# EAGLE design ir_remote_v3 (EAGLE 8.3.1)
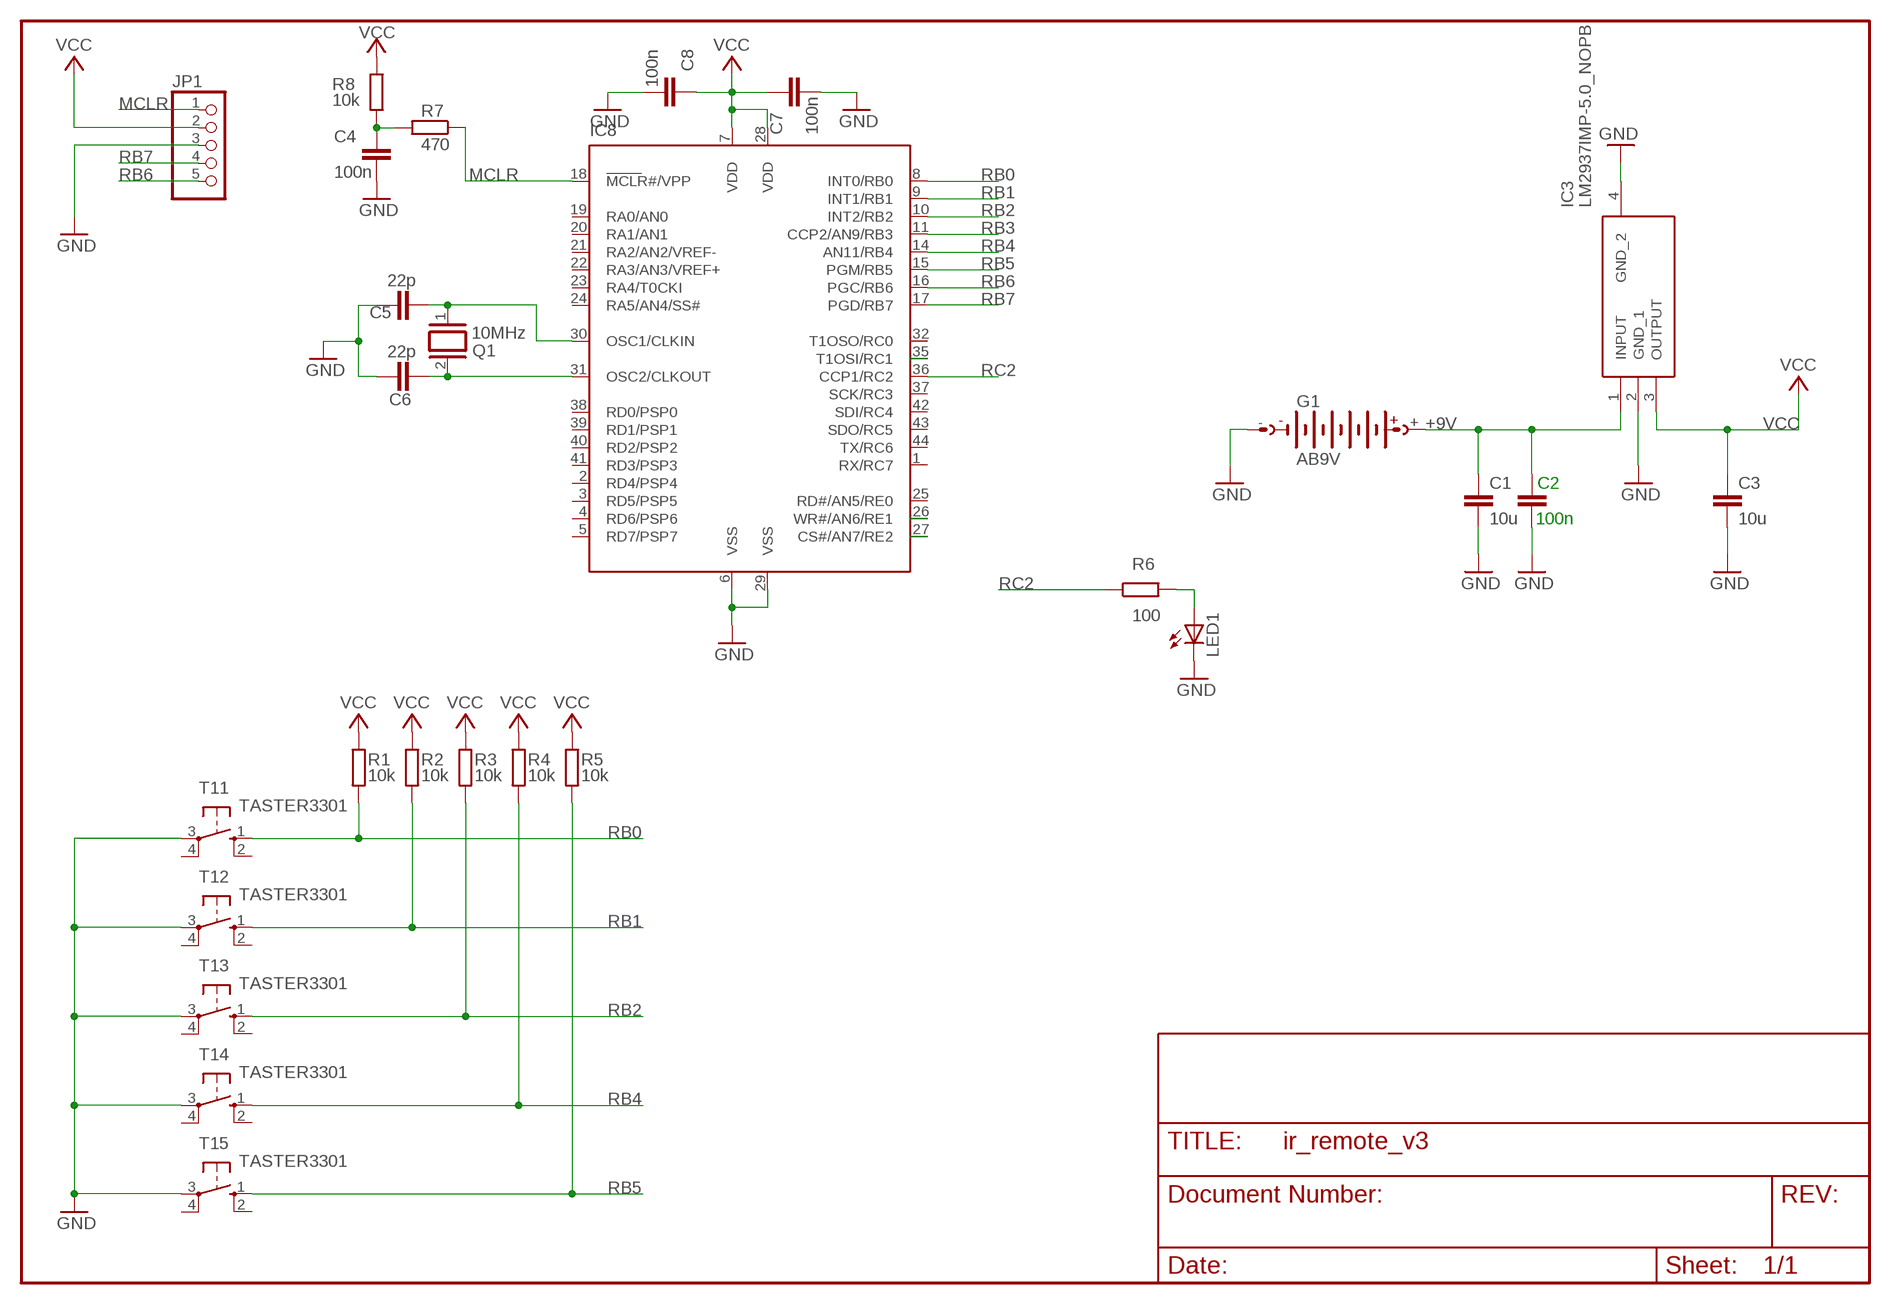
[diagram p0: schematic, sheet 1]

## Parts
C1  10u  C-EUC0805  [C0805]
C2  100n  C-EUC0805  [C0805]
C3  10u  C-EUC0805  [C0805]
C4  100n  C-EUC0805  [C0805]
C5  22p  C-EUC0603_WE  [C0603_WE]
C6  22p  C-EUC0603_WE  [C0603_WE]
C7  100n  C-EUC0805  [C0805]
C8  100n  C-EUC0805  [C0805]
G1  AB9V  [AB9V]
IC3  LM2937IMP-5.0_NOPB  [SOT230P700X180-4N]
IC8  PIC18F4520  [TQFP44]
JP1  PINHD-1X5  [1X05]
LED1  LED5MM  [LED5MM]
Q1  10MHz  XTAL_HC5032  [QUARZ_HC5032/2]
R1  10k  R-EU_M0805  [M0805]
R2  10k  R-EU_M0805  [M0805]
R3  10k  R-EU_M0805  [M0805]
R4  10k  R-EU_M0805  [M0805]
R5  10k  R-EU_M0805  [M0805]
R6  100  R-EU_M0805  [M0805]
R7  470  R-EU_M0805  [M0805]
R8  10k  R-EU_M0805  [M0805]
T11  TASTER3301  [TASTER3301]
T12  TASTER3301  [TASTER3301]
T13  TASTER3301  [TASTER3301]
T14  TASTER3301  [TASTER3301]
T15  TASTER3301  [TASTER3301]

## Nets
+9V: C1.1 C2.1 G1.+ IC3.1(INPUT)
D0_LCD: IC8.27(CS#/AN7/RE2)
D1_LCD: IC8.26(WR#/AN6/RE1)
GND: C1.2 C2.2 C3.2 C4.2 C5.1 C6.1 C7.2 C8.2 G1.- IC3.2(GND_1) IC3.4(GND_2) IC8.6(VSS) IC8.29(VSS) JP1.3 LED1.K(C) T11.3(P) T12.3(P) T13.3(P) T14.3(P) T15.3(P)
MCLR: IC8.18(MCLR#/VPP) JP1.1 R7.1
N$19: LED1.A R6.2
N$24: C4.1 R7.2 R8.2
N$47: C5.2 IC8.30(OSC1/CLKIN) Q1.1
N$48: C6.2 IC8.31(OSC2/CLKOUT) Q1.2
RB0: IC8.8(INT0/RB0) R1.2 T11.1(S)
RB1: IC8.9(INT1/RB1) IC8.35(T1OSI/RC1) R2.2 T12.1(S)
RB2: IC8.10(INT2/RB2) IC8.32(T1OSO/RC0) R3.2 T13.1(S)
RB3: IC8.11(CCP2/AN9/RB3)
RB4: IC8.14(AN11/RB4) R4.2 T14.1(S)
RB5: IC8.15(PGM/RB5) R5.2 T15.1(S)
RB6: IC8.16(PGC/RB6) JP1.5
RB7: IC8.17(PGD/RB7) JP1.4
RC2: IC8.36(CCP1/RC2) R6.1
VCC: C3.1 C7.1 C8.1 IC3.3(OUTPUT) IC8.7(VDD) IC8.28(VDD) JP1.2 R1.1 R2.1 R3.1 R4.1 R5.1 R8.1
Unconnected: IC8.1(RX/RC7) IC8.2(RD4/PSP4) IC8.3(RD5/PSP5) IC8.4(RD6/PSP6) IC8.5(RD7/PSP7) IC8.19(RA0/AN0) IC8.20(RA1/AN1) IC8.21(RA2/AN2/VREF-) IC8.22(RA3/AN3/VREF+) IC8.23(RA4/T0CKI) IC8.24(RA5/AN4/SS#) IC8.25(RD#/AN5/RE0) IC8.37(SCK/RC3) IC8.38(RD0/PSP0) IC8.39(RD1/PSP1) IC8.40(RD2/PSP2) IC8.41(RD3/PSP3) IC8.42(SDI/RC4) IC8.43(SDO/RC5) IC8.44(TX/RC6) T11.2(S1) T11.4(P1) T12.2(S1) T12.4(P1) T13.2(S1) T13.4(P1) T14.2(S1) T14.4(P1) T15.2(S1) T15.4(P1)

## Library data of the parts
C1 C3-C8 = rcl:C-EU: CAPACITOR, European symbol
C2 = rcl_416:C-EU: CAPACITOR, European symbol
G1 = battery:AB9V: 9-V BATTERY CLIP
IC3 = LM2937IMP-5.0_NOPB:LM2937IMP-5.0_NOPB: 500-mA Low Dropout Regulator Source: Datasheet <https://datasheet.datasheetarchive.com/originals/distributors/Datasheets-SFU2/DSASFU100036586.pdf>; DESCRIPTION: 500-mA Low Dropout Regulator; HEIGHT: 1.8mm; MANUFACTURER_NAME: Texas Instruments; MANUFACTURER_PART_NUMBER: LM2937IMP-5.0/NOPB
IC8 = Bernd:PIC18F4520
JP1 = pinhead:PINHD-1X5: PIN HEADER
LED1 = led:LED: LED OSRAM: - CHIPLED LG R971, LG N971, LY N971, LG Q971, LY Q971, LO R971, LY R971 LH N974, LH R974 LS Q976, LO Q976, LY Q976 LO Q996 - Hyper CHIPLED LW Q18S LB Q993, LB Q99A, LB R99A - SideLED LS A670, LO A670, LY A670, LG A670, LP A670 LB A673, LV A673, LT A673, LW A673 LH A674 LY A675 LS A676, LA A676, LO A676, LY A676, LW A676 LS A679, LY A679, LG A679 - Hyper Micro SIDELED® LS Y876, LA Y876, LO Y876, LY Y876 LT Y87S - SmartLED LW L88C, LW L88S LB L89C, LB L89S, LG L890 LS L89K, LO L89K, LY L89K LS L896, LA L896, LO L896, LY L896 - TOPLED LS T670, LO T670, LY T670, LG T670, LP T670 LSG T670, LSP T670, LSY T670, LOP T670, LYG T670 LG T671, LOG T671, LSG T671 LB T673, LV T673, LT T673, LW T673 LH T674 LS T676, LA T676, LO T676, LY T676, LB T676, LH T676, LSB T676, LW T676 LB T67C, LV T67C, LT T67C, LS T67K, LO T67K, LY T67K, LW E67C LS E67B, LA E67B, LO E67B, LY E67B, LB E67C, LV E67C, LT E67C LW T67C LS T679, LY T679, LG T679 LS T770, LO T770, LY T770, LG T770, LP T770 LB T773, LV T773, LT T773, LW T773 LH T774 LS E675, LA E675, LY E675, LS T675 LS T776, LA T776, LO T776, LY T776, LB T776 LHGB T686 LT T68C, LB T68C - Hyper Mini TOPLED® LB M676 - Mini TOPLED Santana® LG M470 LS M47K, LO M47K, LY M47K Source: http://www.osram.convergy.de LUXEON: - LUMILED® LXK2-PW12-R00, LXK2-PW12-S00, LXK2-PW14-U00, LXK2-PW14-V00 LXK2-PM12-R00, LXK2-PM12-S00, LXK2-PM14-U00 LXK2-PE12-Q00, LXK2-PE12-R00, LXK2-PE12-S00, LXK2-PE14-T00, LXK2-PE14-U00 LXK2-PB12-K00, LXK2-PB12-L00, LXK2-PB12-M00, LXK2-PB14-N00, LXK2-PB14-P00, LXK2-PB14-Q00 LXK2-PR12-L00, LXK2-PR12-M00, LXK2-PR14-Q00, LXK2-PR14-R00 LXK2-PD12-Q00, LXK2-PD12-R00, LXK2-PD12-S00 LXK2-PH12-R00, LXK2-PH12-S00 LXK2-PL12-P00, LXK2-PL12-Q00, LXK2-PL12-R00 Source: www.luxeon.com KINGBRIGHT: KA-3528ASYC Source: www.kingbright.com
Q1 = Bernd:XTAL: 9HT10-32.768KDZF-T RS: 753-7265P Farnell: 2061724
R1-R8 = rcl:R-EU_: RESISTOR, European symbol
T11-T15 = Bernd:TASTER3301

## Board
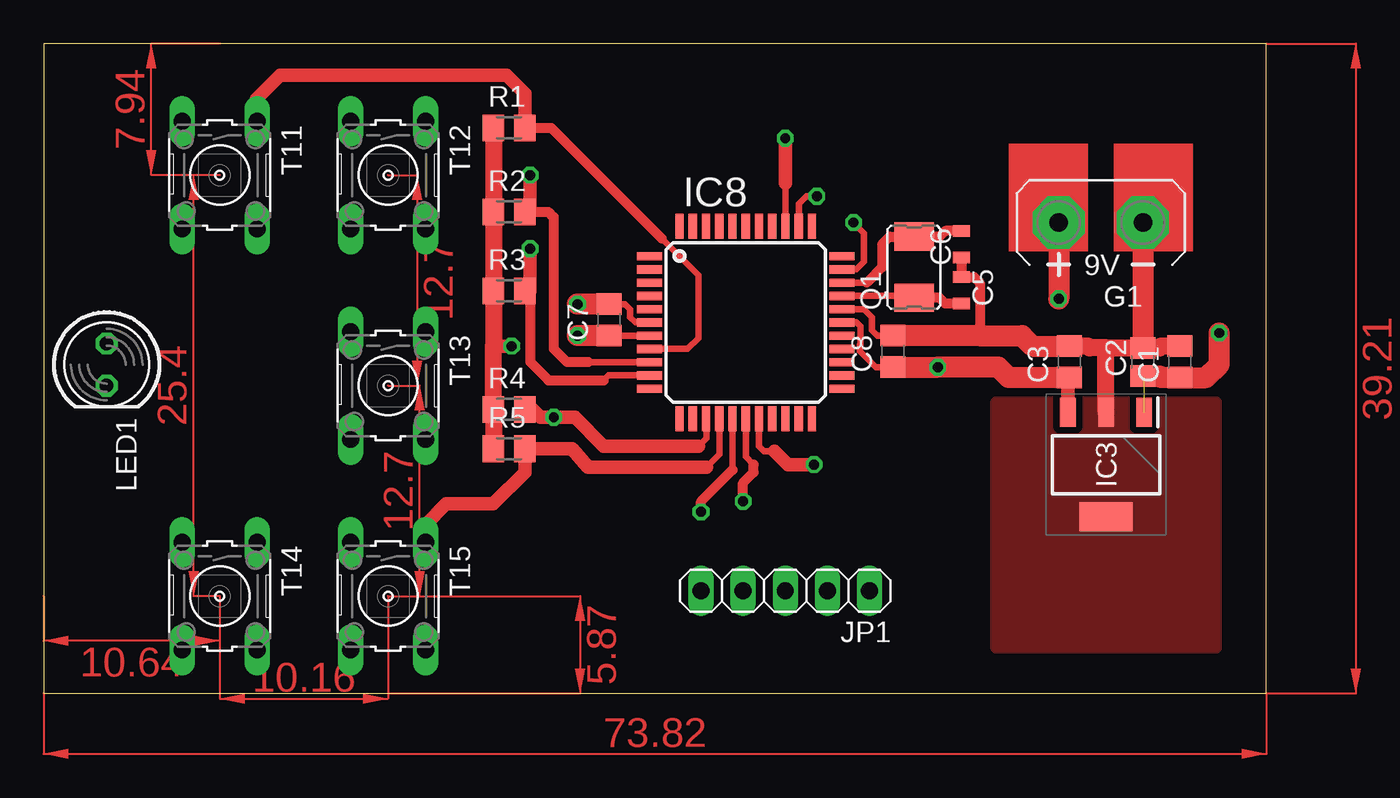
[diagram p1: board, top side]
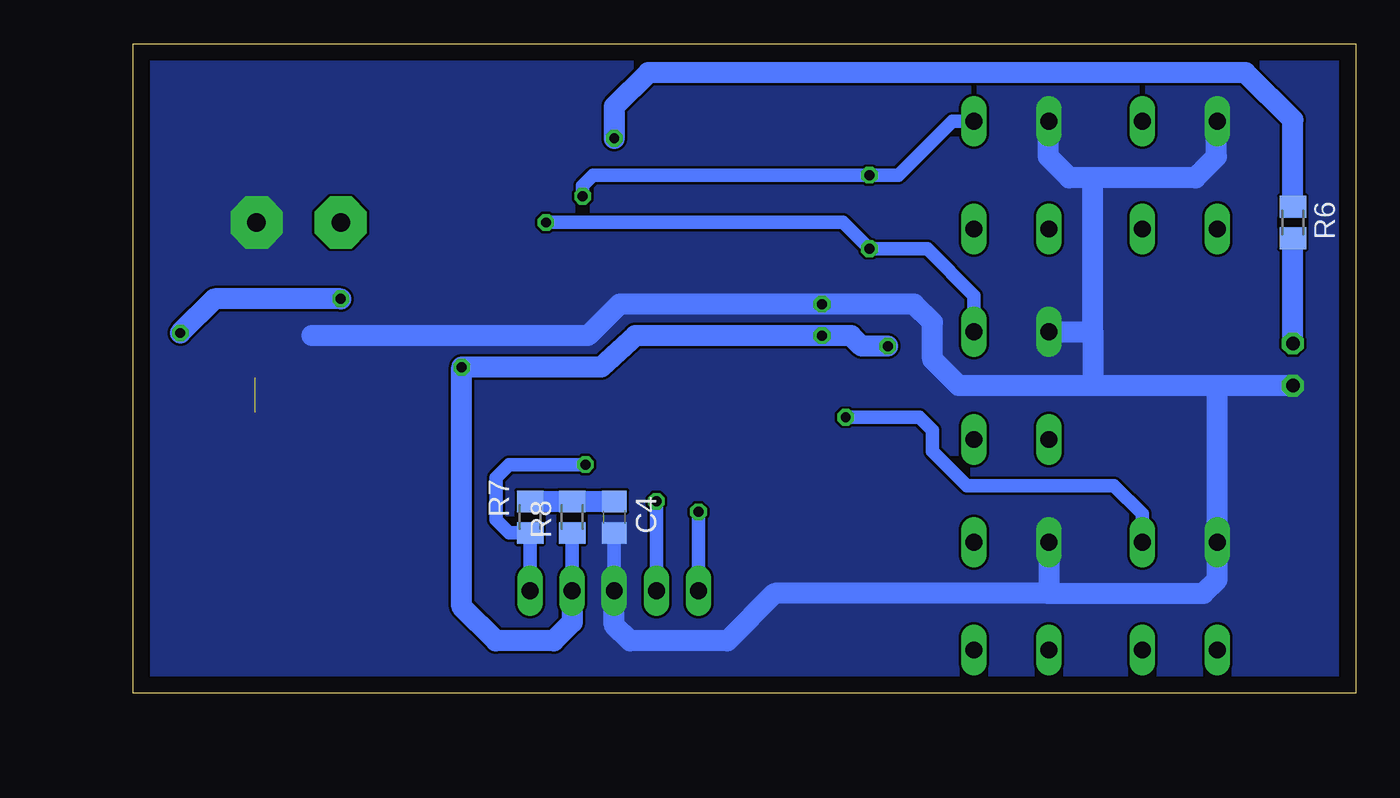
[diagram p2: board, bottom side, seen from below]

Size 73.81 x 39.2 mm. Coordinates in mm from the lower left corner, seen from the top.
Outline: 0,0 73.81,0 73.81,39.2 0,39.2 0,0
Copper layers (1*16): Top 0.035mm / dielectric 1.5mm / Bottom 0.035mm
Design rules "default": minimum track width 6mil, minimum drill 0.35mm, track to track 6mil, track to pad 6mil, pad to pad 6mil, via to via 6mil, smd to smd 6mil, copper to edge 40mil, drill to drill 6mil, minimum pad ring 10mil, minimum via ring 8mil, stop-mask expansion 4mil, vias tented up to drill 0mil, thermal gap 10mil

### Footprints (pad centres in the part's own frame; a part is rotated, then mirrored left to right if it is on the bottom)
C0805 = smd 1.3 x 1.5: 1 -0.95,0; 2 0.95,0
C0805' = smd 1.3 x 1.5: 1 -0.85,0; 2 0.85,0
C0603_WE = smd 0.7 x 1: 1 -0.8,0; 2 0.8,0
AB9V = drill 1.118 pad 3.15 octagon: + 0,2.54; - 0,-2.54
SOT230P700X180-4N = smd 1.75 x 0.95: 1 -3.15,2.3; 2 -3.15,0; 3 -3.15,-2.3 | smd 1.75 x 3.2: 4 3.15,0
TQFP44 = smd 1.5 x 0.5: 1 -5.8,4; 2 -5.8,3.2; 3 -5.8,2.4; 4 -5.8,1.6; 5 -5.8,0.8; 6 -5.8,0; 7 -5.8,-0.8; 8 -5.8,-1.6; 9 -5.8,-2.4; 10 -5.8,-3.2; 11 -5.8,-4; 23 5.8,-4; 24 5.8,-3.2; 25 5.8,-2.4; 26 5.8,-1.6; 27 5.8,-0.8; 28 5.8,0; 29 5.8,0.8; 30 5.8,1.6; 31 5.8,2.4; 32 5.8,3.2; 33 5.8,4 | smd 0.5 x 1.5: 12 -4,-5.8; 13 -3.2,-5.8; 14 -2.4,-5.8; 15 -1.6,-5.8; 16 -0.8,-5.8; 17 0,-5.8; 18 0.8,-5.8; 19 1.6,-5.8; 20 2.4,-5.8; 21 3.2,-5.8; 22 4,-5.8; 34 4,5.8; 35 3.2,5.8; 36 2.4,5.8; 37 1.6,5.8; 38 0.8,5.8; 39 0,5.8; 40 -0.8,5.8; 41 -1.6,5.8; 42 -2.4,5.8; 43 -3.2,5.8; 44 -4,5.8
1X05 = drill 1.016 long: 1 -5.08,0; 2 -2.54,0; 3 0,0; 4 2.54,0; 5 5.08,0
LED5MM = drill 0.813 octagon: A -1.27,0; K 1.27,0
QUARZ_HC5032/2 = smd 1.7 x 2.4: 1 -1.85,0; 2 1.85,0
M0805 = smd 1.3 x 1.6: 1 -0.95,0; 2 0.95,0
TASTER3301 = drill 1.016 long: 1 -3.251,2.261; 2 3.251,2.261; 3 -3.251,-2.261; 4 3.251,-2.261

### Placement (x,y rotation side)
C1  68.58,20 90 top
C2  100n  [C0805']  66.36,20 90 top
C3  61.91,20 90 top
C4  44.77,10.64 270 bottom
C5  55.4,24.32 270 top
C6  55.4,27.11 90 top
C7  34.13,22.54 90 top
C8  51.28,20.64 90 top
G1  63.82,28.42 90 top
IC3  64.14,13.81 270 top
IC8  42.39,22.38 0 top
JP1  44.77,6.19 180 top
LED1  3.81,19.84 270 top
Q1  52.55,25.72 90 top
R1  28.1,34.13 0 top
R2  28.1,29.05 0 top
R3  28.1,24.29 0 top
R4  28.1,17.14 0 top
R5  28.1,14.76 0 top
R6  3.81,28.42 270 bottom
R7  49.85,10.64 90 bottom
R8  47.31,10.64 90 bottom
T11  10.64,31.27 270 top
T12  20.8,31.27 270 top
T13  20.8,18.57 270 top
T14  10.64,5.87 270 top
T15  20.8,5.87 270 top

### Tracks (layer width: path | path; a pad name or v marks a point on that pad's centre or on a via)
+9V  (via drill 0.6)  (1 unrouted)
  Top 0.813: 68.66,18.97 C1.1
  Top 1.016: 66.46,19.05 C2.1
  Top 1.27: C2.1 67.37,19.15 67.47,19.05 C1.1 70.17,19.05 70.96,19.84 v70.96,21.75 | G1.+ v61.28,23.81
  Bottom 1.27: v61.28,23.81 68.9,23.81 v70.96,21.75
GND  (via drill 0.6)
  Top 0.406: IC8.6 35.72,22.38 35.4,22.7 35.4,23.18 35.09,23.49 C7.2 | C8.2 50.33,21.59 50.01,21.91 50.01,22.7 49.52,23.18 IC8.29
  Top 0.61: C6.1 C5.1 56.16,25.12 56.52,24.77 56.52,21.64 56.46,21.59
  Top 1.016: 64.18,20.85 C2.2 67.37,20.85 67.47,20.95 C1.2 | 64.18,20.85 63.13,20.85 63.02,20.95 C3.2 | IC3.2 64.14,20.81 64.18,20.85
  Top 1.27: C7.2 v32.23,23.49 v32.23,23.5 | C1.2 | C8.2 56.46,21.59 59.06,21.59 59.69,20.95 C3.2 | G1.- C2.2
  Bottom 0.813: JP1.3 C4.2
  Bottom 1.27: 15.88,21.81 15.88,18.57 | T13.3 15.89,21.82 15.88,21.81 | 15.88,31.11 9.68,31.11 8.41,32.38 8.41,34.49 T11.3 | 15.88,21.81 15.88,31.11 | 15.88,31.11 17.3,31.11 18.57,32.38 18.57,34.49 T12.3 | JP1.3 44.77,4.13 43.81,3.17 37.94,3.17 35.08,6.03 18.61,6.03 | 18.61,6.03 9.21,6.03 8.38,6.86 T14.3 8.38,18.54 8.41,18.57 | T15.3 18.54,6.1 18.61,6.03 | 15.88,18.57 23.97,18.57 25.56,20.16 25.56,22.38 26.67,23.5 v32.23,23.5 44.45,23.5 46.35,21.59 63.02,21.59 | LED1.K 8.41,18.57 | 8.41,18.57 15.88,18.57
  pour Bottom (no thermals): 0,39.21 0,0 73.82,0 73.82,39.21
  pour Top (isolate 0.406, no thermals): 70.8,2.7 57.47,2.7 57.47,17.62 70.8,17.62
MCLR  (via drill 0.6)
  Top 0.406: 44.13,14.61 43.5,14.61 43.18,14.92 IC8.18
  Top 0.813: v46.51,13.81 44.93,13.81 44.13,14.61
  Bottom 0.813: JP1.1 R7.1 51.12,9.69 51.91,10.48 51.91,13.02 51.12,13.81 v46.51,13.81
N$19
  Bottom 1.27: LED1.A R6.2
N$24
  Bottom 1.27: C4.1 R8.2 R7.2
N$47
  Top 0.406: 52.33,23.65 Q1.1 52.43,23.98 IC8.30
  Top 0.61: C5.2 54.43,23.52 54.08,23.87 Q1.1
N$48
  Top 0.406: 49.69,24.78 IC8.31
  Top 0.61: 49.69,24.78 50.64,25.74 50.64,27.15 51.06,27.57 Q1.2 54.08,27.57 54.43,27.91 C6.2
RB0
  Top 0.406: IC8.8 38.88,20.78 39.53,21.43 39.53,25.24 37.31,27.46
  Top 0.61: R1.2 30.64,34.13 37.31,27.46
  Top 0.813: T11.1 12.86,34.56 12.86,35.88 14.29,37.31 27.94,37.31 29.05,36.2 R1.2
RB1  (via drill 0.6)
  Top 0.406: 29.37,29.37 R2.2 | v46.67,30 46.04,30 45.59,29.55 IC8.35 | 36.57,20 IC8.9 32.88,19.98 32.86,20
  Top 0.61: R2.2 30.48,29.05 30.8,28.73 30.8,20.8 31.61,19.98 32.88,19.98
  Top 0.813: v29.37,31.27 29.37,29.37
  Bottom 0.813: T12.1 24.37,34.52 27.62,31.27 v29.37,31.27 46.04,31.27 46.67,30.64 v46.67,30
RB2  (via drill 0.6)
  Top 0.406: 29.37,24.61 R3.2 | IC8.32 49.08,25.58 49.53,26.04 49.53,27.78 v48.9,28.42 | IC8.10 34.11,19.18 33.81,18.89
  Top 0.61: 29.37,24.29 29.37,20 30.48,18.89 33.81,18.89
  Top 0.813: v29.37,26.83 29.37,24.61 29.37,24.29
  Bottom 0.813: T13.1 23.06,24.01 25.88,26.83 v29.37,26.83 30.96,28.42 v48.9,28.42
RB4  (via drill 0.6)
  Top 0.406: 39.53,14.92 40.01,15.4 40.01,16.57 IC8.14
  Top 0.813: R4.2 29.53,17.14 30,16.67 v30.8,16.67 32.07,16.67 33.81,14.92 39.53,14.92
  Bottom 0.813: v30.8,16.67 26.35,16.67 25.56,15.88 25.56,14.61 23.5,12.54 14.61,12.54 12.9,10.83 T14.1
RB5
  Top 0.406: IC8.15 40.8,14.45 40.01,13.65
  Top 0.813: 40.01,13.65 32.86,13.65 31.91,14.76 R5.2 29.05,13.33 27.15,11.43 24.29,11.43 23.02,10.16 23.02,9.16 T15.1
RB6  (via drill 0.6)
  Top 0.406: 41.59,13.49 41.59,13.5 IC8.16
  Top 0.61: v39.69,10.95 39.69,11.59 41.59,13.49
  Bottom 0.813: v39.69,10.95 JP1.5
RB7  (via drill 0.6)
  Top 0.406: 42.86,13.81 42.39,14.29 IC8.17
  Top 0.61: v42.23,11.59 42.23,12.7 42.86,13.34 42.86,13.81
  Bottom 0.813: v42.23,11.59 JP1.4
RC2  (via drill 0.6)
  Top 0.406: 44.77,30.8 44.77,28.2 IC8.36
  Top 0.813: v44.77,33.5 44.77,30.8
  Bottom 1.27: R6.1 3.81,34.61 6.67,37.47 42.7,37.47 44.77,35.4 v44.77,33.5
VCC  (via drill 0.6)
  Top 0.406: IC8.7 C7.1 | IC8.28 49.06,22.38 49.29,22.15 49.29,21.04 49.29,21.03 49.29,20.64 50.24,19.69 C8.1
  Top 0.813: 27.15,20.95 v28.26,20.95 | IC3.3 61.84,18.98 C3.1
  Top 1.016: R1.1 R2.1 R3.1 27.15,20.95 R4.1 R5.1
  Top 1.27: C8.1 | C8.1 | C7.1 v32.23,21.59 | C3.1 58.26,19.05 57.62,19.69 v53.98,19.69 v53.98,19.68 v53.97,19.69 C8.1
  Bottom 0.813: R8.1 JP1.2
  Bottom 1.27: JP1.2 47.31,4.29 48.42,3.17 51.91,3.17 53.98,5.24 v53.98,19.68 45.56,19.68 43.5,21.59 v32.23,21.59 30.48,21.59 29.84,20.95 v28.26,20.95
(copper drawn outside any net)
  shapes: Top area x11